# Altium schematic sheet BOOST.SchDoc
size A4; SheetNumber: 3; SheetTotal: 4
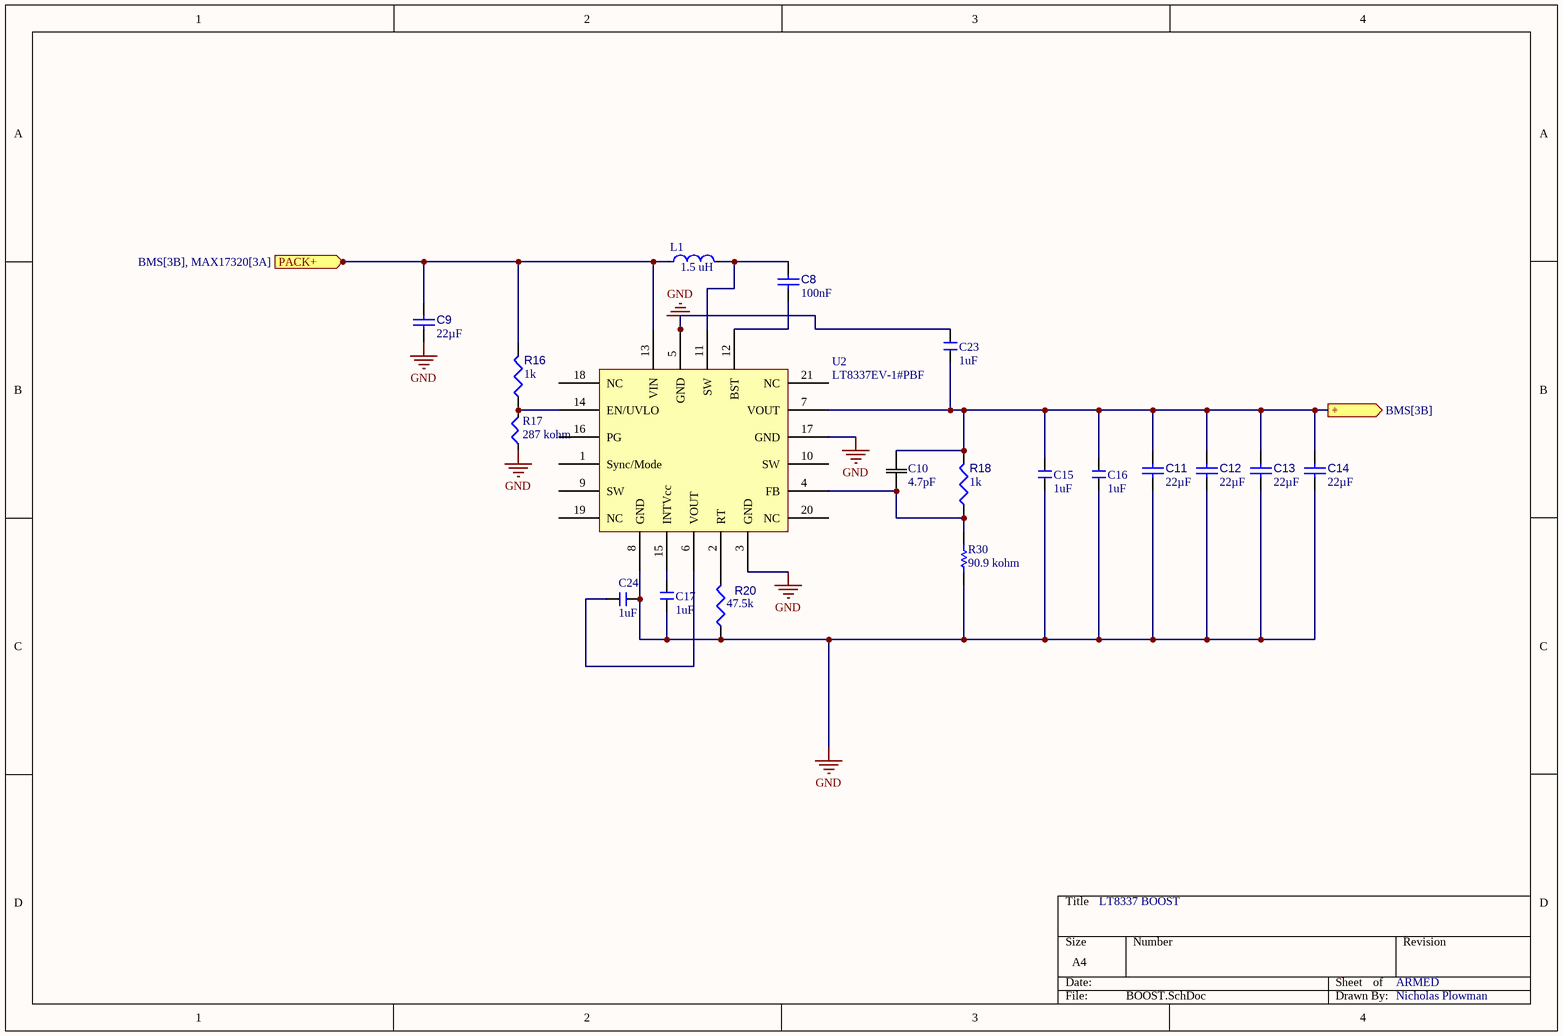
[diagram p0: BOOST.SchDoc]

## Parts
C8  value 100nF  [CAPC1005X56X25LL10T15]  (hidden comment: Capacitor 0.1 uF +/- 5% 16 V 0402)
C9  value 22µF  [CAPC0805(2012)145_L]  (hidden comment: Capacitor 22µF +/-40% 16V 0805)
C10  Parameter 1: 4.7pF  [600L4R7BT200T4K-Footprint-1]  (hidden comment: 600L4R7BT200T4K)
C11  value 22µF  [CAPC0805(2012)145_L]  (hidden comment: Capacitor 22µF +/-40% 16V 0805)
C12  value 22µF  [CAPC0805(2012)145_L]  (hidden comment: Capacitor 22µF +/-40% 16V 0805)
C13  value 22µF  [CAPC0805(2012)145_L]  (hidden comment: Capacitor 22µF +/-40% 16V 0805)
C14  value 22µF  [CAPC0805(2012)145_L]  (hidden comment: Capacitor 22µF +/-40% 16V 0805)
C15  25V 1uF 0603 CAP  [25V 1uF 0603 CAP-Footprint-1]  (value not drawn)
C16  25V 1uF 0603 CAP  [25V 1uF 0603 CAP-Footprint-1]  (value not drawn)
C17  25V 1uF 0603 CAP  [25V 1uF 0603 CAP-Footprint-1]  (value not drawn)
C23  25V 1uF 0603 CAP  [25V 1uF 0603 CAP-Footprint-1]  (value not drawn)
C24  25V 1uF 0603 CAP  [25V 1uF 0603 CAP-Footprint-1]  (value not drawn)
L1  value 1.5 uH  [FP-LB3225-2_5-0_2-IPC_A]  (hidden comment: LBC3225T1R5MR)
R16  value 1k  [RESC0805(2012)_L]  (hidden comment: 1KR5J)
R17  Parameter 1: 287 kohm  [RMCF0603FT287K-Footprint-1]  (hidden comment: RMCF0603FT287K)
R18  value 1k  [RESC0805(2012)_L]  (hidden comment: 1KR5J)
R20  value 47.5k  [RESC0402(1005)_L]  (hidden comment: 47D5KR2F)
R30  Parameter 1: 90.9 kohm  [RESC1005X40X25ML05T10]  (hidden comment: RC0402FR-0790K9L)
U2  LT8337EV-1#PBF  [LT8337EV-1#PBF-Footprint-1]

## Ports
+ (out, see BMS[3B]), PACK+ (in, see BMS[3B], MAX17320[3A])

## Nets
GND: C9.1 C11.1 C12.1 C13.1 C14.1 C15.1 C16.1 C17.1 C23.1 C24.1 R17.1 R20.1 R30.1 U2.3(GND) U2.5(GND) U2.8(GND) U2.17(GND)
+: C10.2 C11.2 C12.2 C13.2 C14.2 C15.2 C16.2 C23.2 R18.2 U2.7(VOUT) ; port +
PACK+: C9.2 L1.1 R16.2 U2.13(VIN) ; port PACK+
NetC8_1: C8.1 U2.12(BST)
NetC8_2: C8.2 L1.2 U2.11(SW)
NetC10_1: C10.1 R18.1 R30.2 U2.4(FB)
NetC17_2: C17.2 U2.15(INTVcc)
NetC24_2: C24.2 U2.6(VOUT)
NetR16_1: R16.1 R17.2 U2.14(EN/UVLO)
NetR20_2: R20.2 U2.2(RT)

Not connected (* = marked no-connect by the designer): U2 1(Sync/Mode) 9(SW) 10(SW) 16(PG) 18(NC) 19(NC) 20(NC) 21(NC)

## Notes on the sheet
- LT8337 BOOST
- ARMED
- Nicholas Plowman

## Library data of the parts
C8 = CMP-001-00001-6: Chip Capacitor, 0.1 uF, +/- 5%, 16 V, 0402 (1005 Metric); Capacitor Type: Ceramic; Voltage Rating: 16V; Max Operating Temperature: 125°C; Min Operating Temperature: -55°C; Case/Package: 0402; Mounting Technology: SM; Pins: 2; Tolerance: 5%; RoHS Compliant: True
C9 C11-C14 = CMP-001-00081-4: Chip Capacitor, 22µF +/-40%, 16V, 0805, Thickness 1.45 mm; Tolerance: 5%; Voltage Rating: 16V; Mounting Technology: SMT; Pins: 2; Max Operating Temperature: 85°C; Case/Package: 0805; Min Operating Temperature: -55°C
C10 = CMP-001-00089-1: Cap Cer 4.7PF 200V C0G/NP0 0402
C15-C17 C23 C24 = CMP-001-00085-1: 0603 1 uF 25 V ±10 % Tolerance X5R SMT Multilayer Ceramic Capacitor; Parameter 1: 1uF
L1 = CMP-006-00023-2: 1.5 uH
R16 R18 = CMP-009-00076-2: 1K 0.125W 5% 0805 (2012 Metric)  SMD; Power: 125mW; Pins: 2; Mounting Technology: SMT; Tolerance: 5%; Case/Package: 0805
R17 = CMP-009-00178-3: Res Thick Film 0603 287K Ohm 1% 1/10W ±100ppm/°C Molded SMD SMD Paper T/R; Case Code (Metric): 1608; Case Code (Imperial): 0603; Contact Plating: Tin,Matte; Case/Package: 0603
R20 = CMP-009-00103-2: 47K5 0.063W 1% 0402 (1005 Metric)  SMD; Power: 63mW; Pins: 2; Tolerance: 1%; Mounting Technology: SMT; Case/Package: 0402
R30 = CMP-009-00188-1: SMD Chip Resistor, 90.9 kOhm, ± 1%, 63 mW, 0402 [1005 Metric], Thick Film, General Purpose
U2 = CMP-001-0000-4: Conv DC-DC 2.7V to 28V Synchronous Step Up Single-Out 2.7V to 28V 5A 16-Pin LQFN EP Tray